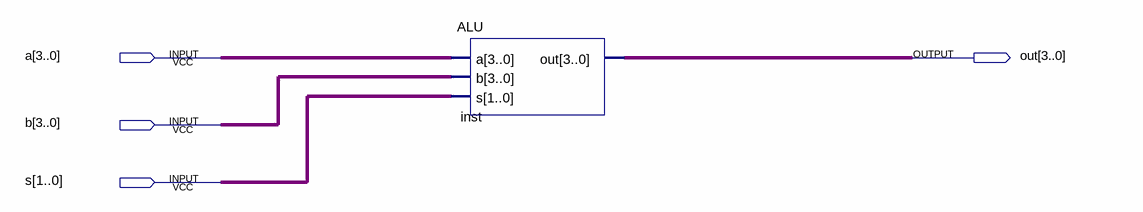
[diagram p0: schematic sheet]
// Quartus schematic finalALU.bdf as structural Verilog: 1 symbols, 4 pins
module finalALU (
  input  [3:0] a,
  input  [3:0] b,
  input  [1:0] s,
  output [3:0] out
);

  ALU inst (.a(a), .b(b), .s(s), .out(out));
endmodule
